# Altium schematic sheet BEMF.SchDoc
size A4; SheetNumber: 4; SheetTotal: 5
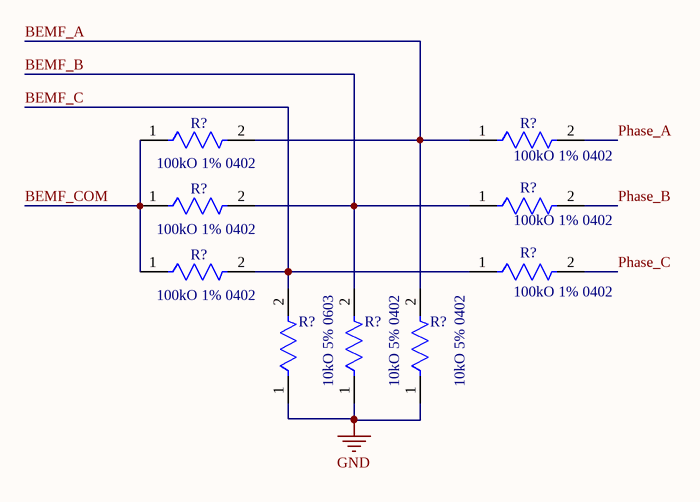
[diagram p0: BEMF.SchDoc]

## Parts
(Parts that share a designator on the sheet are numbered #1, #2 ... from top to bottom, then left to right.)
R?#1  100kO 1% 0402  [FP-CRGP0402-IPC_C]
R?#2  100kO 1% 0402  [FP-CRGP0402-IPC_C]
R?#3  100kO 1% 0402  [FP-CRGP0402-IPC_C]
R?#4  100kO 1% 0402  [FP-CRGP0402-IPC_C]
R?#5  100kO 1% 0402  [FP-CRGP0402-IPC_C]
R?#6  100kO 1% 0402  [FP-CRGP0402-IPC_C]
R?#7  10kO 5% 0603  [FP-AC0603-IPC_A]
R?#8  10kO 5% 0402  [FP-AC0603-IPC_A]
R?#9  10kO 5% 0402  [FP-AC0603-IPC_A]

## Nets
GND: R?#7.1 R?#8.1 R?#9.1
BEMF_A: R?#1.2 R?#2.1 R?#9.2
BEMF_B: R?#3.2 R?#4.1 R?#8.2
BEMF_C: R?#5.2 R?#6.1 R?#7.2
BEMF_COM: R?#1.1 R?#3.1 R?#5.1
Phase_A: R?#2.2
Phase_B: R?#4.2
Phase_C: R?#6.2

## Library data of the parts
R?#1-R?#6 = CMP-03211-001392-1: SMD Precision Pulse Thick Film Chip Resistor; Manufacturer Part Number: CRGP0402F100K; Manufacturer: TE; Value: 100KΩ; Power Rating: 0.125W; Tolerance: 0.01; Temperature Coefficient: ±100ppm/°C; Voltage Rating: 50V; Octopart: https://octopart.com/crgp0402f100k-te+connectivity-91018658; Ipc Land Pattern Name: RESC11050X35; Digikey Description: SMD Precision Pulse Thick Film Chip Resistor; Composition: Thick Film; Device Class L3: Chip SMD Resistors; Package: CRGP0402; Temperature: -55°C to +155°C; Category: Res; Device Class L1: Passive Components; Temperature Range High: +155°C; ComponentLink2URL: https://www.mouser.ca/datasheet/2/418/NG_DS_9-1773463-9_A-1358566.pdf; Temperature Range Low: -55°C; Series: CRGP; Resistance: 100KΩ; Automotive: No; Lead Free: Yes; RoHS: TRUE; Device Class L2: Resistors; Height: 0.4mm; ComponentLink2Description: Datasheet
R?#7-R?#9 = CMP-03412-040683-1: RES 10kΩ 5.00% 0.2W 0603